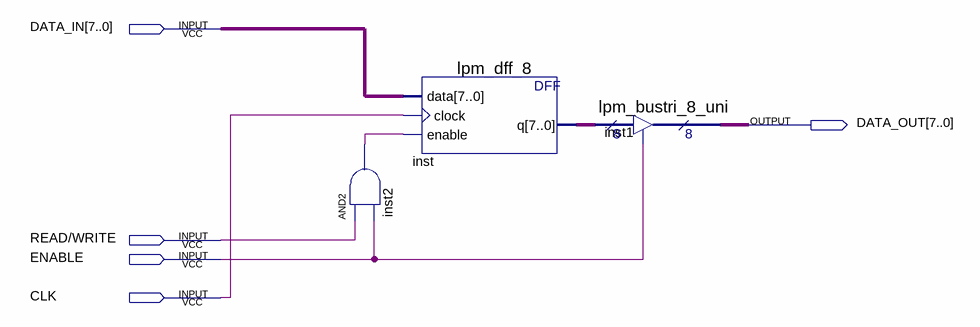
[diagram p0: schematic sheet]
// Quartus schematic register8.bdf as structural Verilog: 3 symbols, 5 pins
module register8 (
  input  [7:0] DATA_IN,
  input  \READ/WRITE ,
  input  ENABLE,
  input  CLK,
  output [7:0] DATA_OUT
);

  wire inst2_out;
  wire [7:0] inst_q;

  and inst2 (inst2_out, \READ/WRITE , ENABLE);
  lpm_dff_8 inst (.data(DATA_IN), .clock(CLK), .enable(inst2_out), .q(inst_q));
  lpm_bustri_8_uni inst1 (.enabledt(ENABLE), .data(inst_q), .tridata(DATA_OUT));
endmodule
